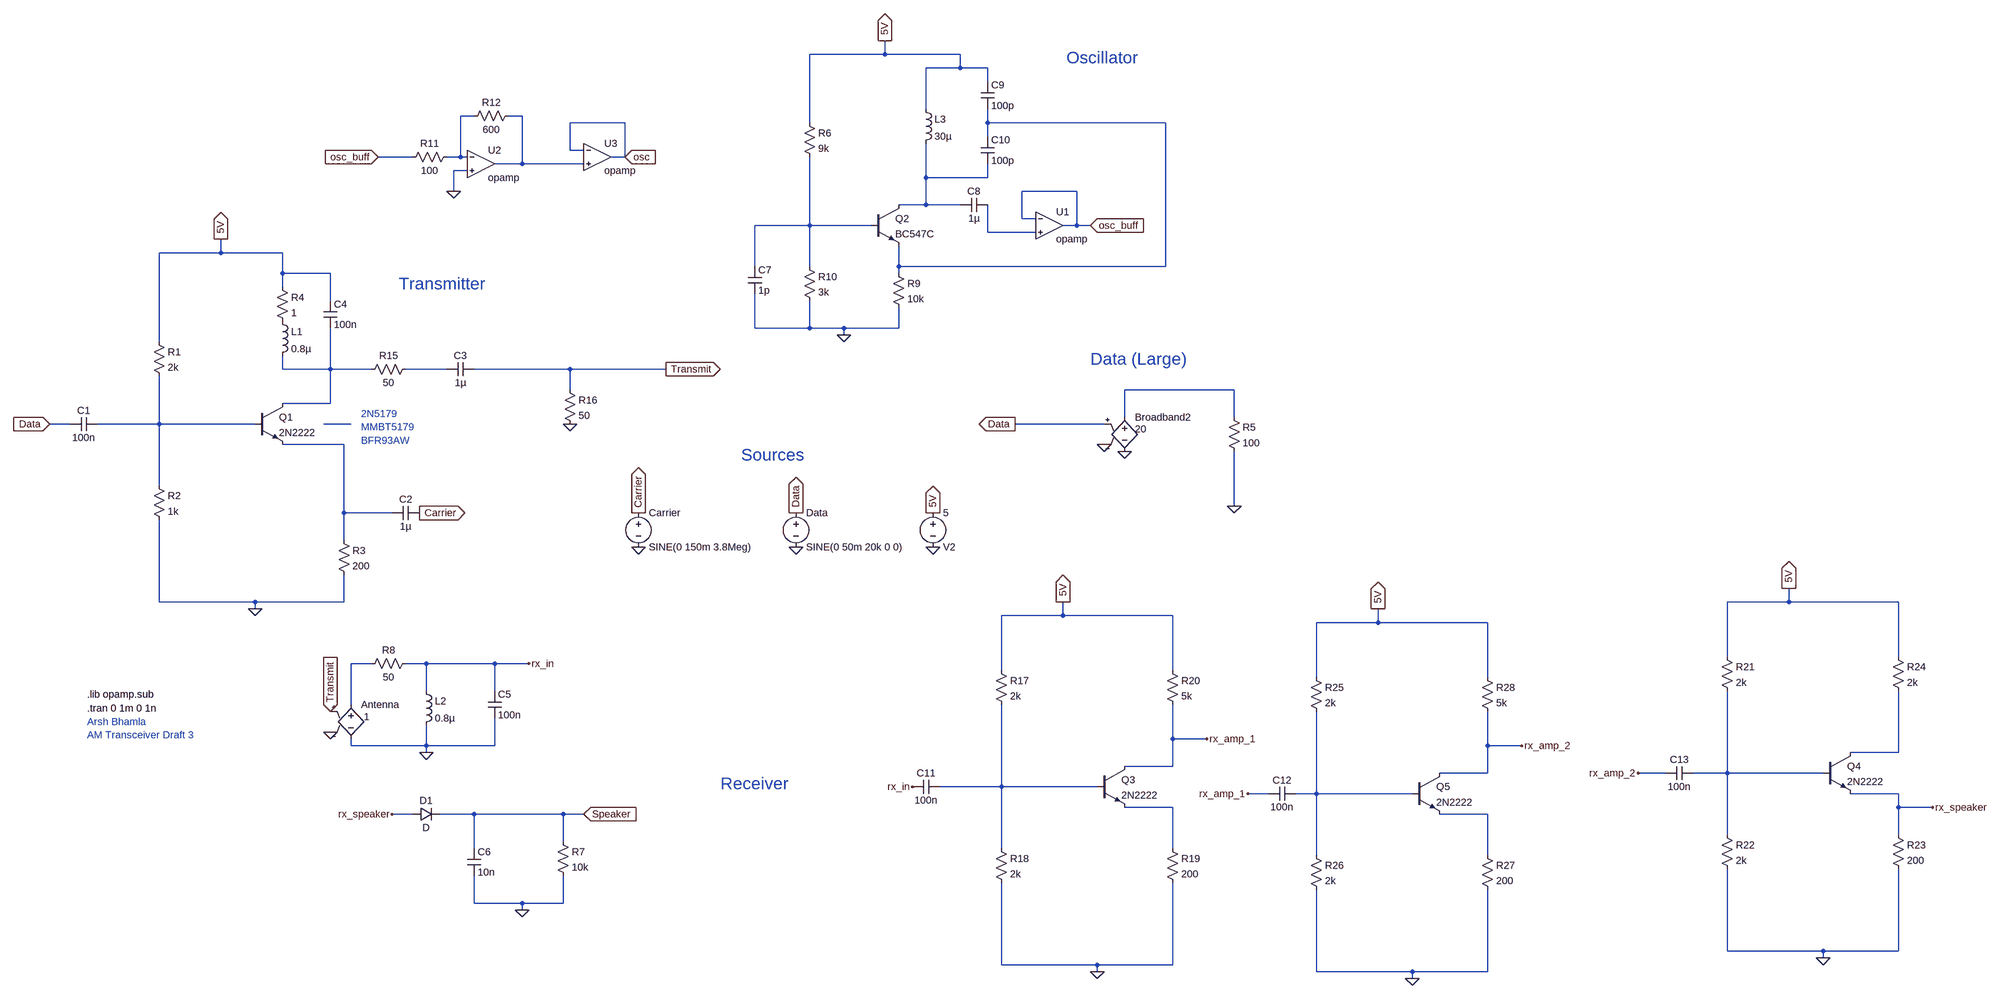
[diagram p0: schematic am_radio_simulation.asc]
am_radio_simulation.asc, the LTspice schematic file:
Version 4.1
SHEET 1 4676 1412
WIRE 2080 -768 2080 -800
WIRE 2080 -768 1904 -768
WIRE 2256 -768 2080 -768
WIRE 2256 -736 2256 -768
WIRE 2256 -736 2176 -736
WIRE 2320 -736 2256 -736
WIRE 2320 -704 2320 -736
WIRE 2176 -640 2176 -736
WIRE 1120 -624 1088 -624
WIRE 1232 -624 1200 -624
WIRE 1472 -608 1344 -608
WIRE 1904 -608 1904 -768
WIRE 2320 -608 2320 -640
WIRE 2736 -608 2320 -608
WIRE 2320 -576 2320 -608
WIRE 1344 -544 1344 -608
WIRE 1376 -544 1344 -544
WIRE 976 -528 896 -528
WIRE 1088 -528 1088 -624
WIRE 1088 -528 1056 -528
WIRE 1104 -528 1088 -528
WIRE 1472 -528 1472 -608
WIRE 1472 -528 1440 -528
WIRE 1232 -512 1232 -624
WIRE 1232 -512 1168 -512
WIRE 1376 -512 1232 -512
WIRE 1104 -496 1072 -496
WIRE 2176 -480 2176 -560
WIRE 2320 -480 2320 -512
WIRE 2320 -480 2176 -480
WIRE 1072 -448 1072 -496
WIRE 2528 -448 2400 -448
WIRE 2176 -416 2176 -480
WIRE 2176 -416 2112 -416
WIRE 2256 -416 2176 -416
WIRE 2400 -384 2400 -448
WIRE 2432 -384 2400 -384
WIRE 1904 -368 1904 -528
WIRE 1904 -368 1776 -368
WIRE 2048 -368 1904 -368
WIRE 2528 -368 2528 -448
WIRE 2528 -368 2496 -368
WIRE 2560 -368 2528 -368
WIRE 2320 -352 2320 -416
WIRE 2432 -352 2320 -352
WIRE 528 -304 528 -336
WIRE 528 -304 384 -304
WIRE 672 -304 528 -304
WIRE 1776 -272 1776 -368
WIRE 1904 -272 1904 -368
WIRE 2112 -272 2112 -320
WIRE 2736 -272 2736 -608
WIRE 2736 -272 2112 -272
WIRE 672 -256 672 -304
WIRE 784 -256 672 -256
WIRE 2112 -256 2112 -272
WIRE 672 -224 672 -256
WIRE 784 -192 784 -256
WIRE 1776 -128 1776 -208
WIRE 1904 -128 1904 -192
WIRE 1904 -128 1776 -128
WIRE 1984 -128 1904 -128
WIRE 2112 -128 2112 -176
WIRE 2112 -128 1984 -128
WIRE 1984 -112 1984 -128
WIRE 384 -96 384 -304
WIRE 672 -32 672 -64
WIRE 784 -32 784 -128
WIRE 784 -32 672 -32
WIRE 880 -32 784 -32
WIRE 1056 -32 960 -32
WIRE 1344 -32 1120 -32
WIRE 1568 -32 1344 -32
WIRE 1344 16 1344 -32
WIRE 2896 16 2640 16
WIRE 784 48 784 -32
WIRE 784 48 672 48
WIRE 2640 80 2640 16
WIRE 2896 80 2896 16
WIRE 176 96 128 96
WIRE 384 96 384 -16
WIRE 384 96 240 96
WIRE 608 96 384 96
WIRE 832 96 768 96
WIRE 2592 96 2384 96
WIRE 816 144 672 144
WIRE 384 240 384 96
WIRE 2896 288 2896 160
WIRE 816 304 816 144
WIRE 928 304 816 304
WIRE 816 368 816 304
WIRE 384 512 384 320
WIRE 608 512 384 512
WIRE 816 512 816 448
WIRE 816 512 608 512
WIRE 4192 512 4192 480
WIRE 4192 512 4048 512
WIRE 4448 512 4192 512
WIRE 608 528 608 512
WIRE 2496 544 2496 512
WIRE 2496 544 2352 544
WIRE 2752 544 2496 544
WIRE 3232 560 3232 528
WIRE 3232 560 3088 560
WIRE 3488 560 3232 560
WIRE 4048 640 4048 512
WIRE 4448 640 4448 512
WIRE 880 656 832 656
WIRE 1008 656 960 656
WIRE 1168 656 1008 656
WIRE 1248 656 1168 656
WIRE 2352 672 2352 544
WIRE 2752 672 2752 544
WIRE 3088 688 3088 560
WIRE 3488 688 3488 560
WIRE 1008 720 1008 656
WIRE 1168 720 1168 656
WIRE 832 752 832 656
WIRE 2752 832 2752 752
WIRE 2832 832 2752 832
WIRE 832 848 832 832
WIRE 1008 848 1008 800
WIRE 1008 848 832 848
WIRE 1168 848 1168 784
WIRE 1168 848 1008 848
WIRE 3488 848 3488 768
WIRE 3568 848 3488 848
WIRE 1008 864 1008 848
WIRE 4448 864 4448 720
WIRE 4448 864 4336 864
WIRE 2752 896 2752 832
WIRE 2752 896 2640 896
WIRE 3488 912 3488 848
WIRE 3488 912 3376 912
WIRE 3904 912 3840 912
WIRE 4048 912 4048 720
WIRE 4048 912 3968 912
WIRE 4272 912 4048 912
WIRE 2352 944 2352 752
WIRE 2352 944 2208 944
WIRE 2576 944 2352 944
WIRE 2976 960 2928 960
WIRE 3088 960 3088 768
WIRE 3088 960 3040 960
WIRE 3312 960 3088 960
WIRE 4448 960 4336 960
WIRE 2752 992 2640 992
WIRE 4448 992 4448 960
WIRE 4528 992 4448 992
WIRE 976 1008 928 1008
WIRE 1120 1008 1040 1008
WIRE 1328 1008 1120 1008
WIRE 1376 1008 1328 1008
WIRE 3488 1008 3376 1008
WIRE 4048 1056 4048 912
WIRE 4448 1056 4448 992
WIRE 1328 1072 1328 1008
WIRE 1120 1088 1120 1008
WIRE 2352 1088 2352 944
WIRE 2752 1088 2752 992
WIRE 3088 1104 3088 960
WIRE 3488 1104 3488 1008
WIRE 1120 1216 1120 1152
WIRE 1232 1216 1120 1216
WIRE 1328 1216 1328 1152
WIRE 1328 1216 1232 1216
WIRE 1232 1232 1232 1216
WIRE 4048 1328 4048 1136
WIRE 4272 1328 4048 1328
WIRE 4448 1328 4448 1136
WIRE 4448 1328 4272 1328
WIRE 4272 1344 4272 1328
WIRE 2352 1360 2352 1168
WIRE 2576 1360 2352 1360
WIRE 2752 1360 2752 1168
WIRE 2752 1360 2576 1360
WIRE 2576 1376 2576 1360
WIRE 3088 1376 3088 1184
WIRE 3312 1376 3088 1376
WIRE 3488 1376 3488 1184
WIRE 3488 1376 3312 1376
WIRE 3312 1392 3312 1376
FLAG 1872 384 0
FLAG 608 528 0
FLAG 2192 384 0
FLAG 1344 96 0
FLAG 784 816 0
FLAG 1232 1232 0
FLAG 2192 304 5V
IOPIN 2192 304 Out
FLAG 528 -336 5V
IOPIN 528 -336 Out
FLAG 1872 304 Data
IOPIN 1872 304 Out
FLAG 128 96 Data
IOPIN 128 96 In
FLAG 1504 384 0
FLAG 1504 304 Carrier
IOPIN 1504 304 Out
FLAG 1568 -32 Transmit
IOPIN 1568 -32 Out
FLAG 784 768 Transmit
IOPIN 784 768 In
FLAG 1008 864 0
FLAG 1376 1008 Speaker
IOPIN 1376 1008 In
FLAG 2384 96 Data
IOPIN 2384 96 Out
FLAG 2592 144 0
FLAG 2640 160 0
FLAG 2896 288 0
FLAG 1984 -112 0
FLAG 2080 -800 5V
IOPIN 2080 -800 Out
FLAG 2560 -368 osc_buff
IOPIN 2560 -368 In
FLAG 896 -528 osc_buff
IOPIN 896 -528 In
FLAG 1072 -448 0
FLAG 1472 -528 osc
IOPIN 1472 -528 In
FLAG 1248 656 rx_in
FLAG 928 1008 rx_speaker
FLAG 2576 1376 0
FLAG 2496 512 5V
IOPIN 2496 512 Out
FLAG 2832 832 rx_amp_1
FLAG 4272 1344 0
FLAG 4192 480 5V
IOPIN 4192 480 Out
FLAG 3840 912 rx_amp_2
FLAG 4528 992 rx_speaker
FLAG 2144 944 rx_in
FLAG 3312 1392 0
FLAG 3232 528 5V
IOPIN 3232 528 Out
FLAG 3568 848 rx_amp_2
FLAG 2928 960 rx_amp_1
FLAG 992 304 Carrier
IOPIN 992 304 Out
SYMBOL voltage 1872 288 R0
WINDOW 123 0 0 Left 0
WINDOW 39 0 0 Left 0
SYMATTR InstName Data
SYMATTR Value SINE(0 50m 20k 0 0)
SYMBOL cap 240 80 R90
WINDOW 0 0 32 VBottom 2
WINDOW 3 32 32 VTop 2
SYMATTR InstName C1
SYMATTR Value 100n
SYMBOL res 368 -112 R0
SYMATTR InstName R1
SYMATTR Value 2k
SYMBOL res 368 224 R0
SYMATTR InstName R2
SYMATTR Value 1k
SYMBOL voltage 2192 288 R0
WINDOW 0 24 96 Left 2
WINDOW 3 24 16 Left 2
WINDOW 123 0 0 Left 0
WINDOW 39 0 0 Left 0
SYMATTR InstName V2
SYMATTR Value 5
SYMBOL voltage 1504 288 R0
WINDOW 123 0 0 Left 0
WINDOW 39 0 0 Left 0
SYMATTR InstName Carrier
SYMATTR Value SINE(0 150m 3.8Meg)
SYMBOL cap 992 288 R90
WINDOW 0 0 32 VBottom 2
WINDOW 3 32 32 VTop 2
SYMATTR InstName C2
SYMATTR Value 1µ
SYMBOL res 800 352 R0
SYMATTR InstName R3
SYMATTR Value 200
SYMBOL npn 608 48 R0
SYMATTR InstName Q1
SYMATTR Value 2N2222
SYMBOL cap 1120 -48 R90
WINDOW 0 0 32 VBottom 2
WINDOW 3 32 32 VTop 2
SYMATTR InstName C3
SYMATTR Value 1µ
SYMBOL res 656 -240 R0
SYMATTR InstName R4
SYMATTR Value 1
SYMBOL res 1328 0 R0
SYMATTR InstName R16
SYMATTR Value 50
SYMBOL e 832 736 R0
WINDOW 3 24 44 Left 2
SYMATTR Value .1
SYMATTR InstName Antenna
SYMBOL ind 656 -160 R0
SYMATTR InstName L1
SYMATTR Value 0.8µ
SYMBOL cap 768 -192 R0
SYMATTR InstName C4
SYMATTR Value 100n
SYMBOL res 976 -48 R90
WINDOW 0 0 56 VBottom 2
WINDOW 3 32 56 VTop 2
SYMATTR InstName R15
SYMATTR Value 50
SYMBOL ind 992 704 R0
SYMATTR InstName L2
SYMATTR Value 0.8µ
SYMBOL cap 1152 720 R0
SYMATTR InstName C5
SYMATTR Value 100n
SYMBOL diode 976 1024 R270
WINDOW 0 32 32 VTop 2
WINDOW 3 0 32 VBottom 2
SYMATTR InstName D1
SYMBOL cap 1104 1088 R0
SYMATTR InstName C6
SYMATTR Value 10n
SYMBOL res 1312 1056 R0
SYMATTR InstName R7
SYMATTR Value 10k
SYMBOL res 976 640 R90
WINDOW 0 0 56 VBottom 2
WINDOW 3 32 56 VTop 2
SYMATTR InstName R8
SYMATTR Value 50
SYMBOL e 2640 64 R0
WINDOW 3 24 44 Left 2
SYMATTR Value 20
SYMATTR InstName Broadband2
SYMBOL res 2880 64 R0
SYMATTR InstName R5
SYMATTR Value 100
SYMBOL res 1888 -624 R0
SYMATTR InstName R6
SYMATTR Value 9k
SYMBOL npn 2048 -416 R0
SYMATTR InstName Q2
SYMATTR Value BC547C
SYMBOL res 2096 -272 R0
SYMATTR InstName R9
SYMATTR Value 10k
SYMBOL res 1888 -288 R0
SYMATTR InstName R10
SYMATTR Value 3k
SYMBOL cap 1760 -272 R0
SYMATTR InstName C7
SYMATTR Value 1p
SYMBOL cap 2320 -432 R90
WINDOW 0 0 32 VBottom 2
WINDOW 3 32 32 VTop 2
SYMATTR InstName C8
SYMATTR Value 1µ
SYMBOL cap 2304 -704 R0
SYMATTR InstName C9
SYMATTR Value 100p
SYMBOL cap 2304 -576 R0
SYMATTR InstName C10
SYMATTR Value 100p
SYMBOL ind 2160 -656 R0
SYMATTR InstName L3
SYMATTR Value 30µ
SYMBOL OpAmps\\opamp 2464 -432 R0
SYMATTR InstName U1
SYMBOL OpAmps\\opamp 1136 -576 R0
SYMATTR InstName U2
SYMBOL res 1072 -544 R90
WINDOW 0 0 56 VBottom 2
WINDOW 3 32 56 VTop 2
SYMATTR InstName R11
SYMATTR Value 100
SYMBOL res 1216 -640 R90
WINDOW 0 0 56 VBottom 2
WINDOW 3 32 56 VTop 2
SYMATTR InstName R12
SYMATTR Value 600
SYMBOL OpAmps\\opamp 1408 -592 R0
SYMATTR InstName U3
SYMBOL res 2336 656 R0
SYMATTR InstName R17
SYMATTR Value 2k
SYMBOL res 2336 1072 R0
SYMATTR InstName R18
SYMATTR Value 2k
SYMBOL res 2736 1072 R0
SYMATTR InstName R19
SYMATTR Value 200
SYMBOL npn 2576 896 R0
SYMATTR InstName Q3
SYMATTR Value 2N2222
SYMBOL res 2736 656 R0
SYMATTR InstName R20
SYMATTR Value 5k
SYMBOL res 4032 624 R0
SYMATTR InstName R21
SYMATTR Value 2k
SYMBOL res 4032 1040 R0
SYMATTR InstName R22
SYMATTR Value 2k
SYMBOL res 4432 1040 R0
SYMATTR InstName R23
SYMATTR Value 200
SYMBOL npn 4272 864 R0
SYMATTR InstName Q4
SYMATTR Value 2N2222
SYMBOL res 4432 624 R0
SYMATTR InstName R24
SYMATTR Value 2k
SYMBOL cap 2208 928 R90
WINDOW 0 0 32 VBottom 2
WINDOW 3 32 32 VTop 2
SYMATTR InstName C11
SYMATTR Value 100n
SYMBOL res 3072 672 R0
SYMATTR InstName R25
SYMATTR Value 2k
SYMBOL res 3072 1088 R0
SYMATTR InstName R26
SYMATTR Value 2k
SYMBOL res 3472 1088 R0
SYMATTR InstName R27
SYMATTR Value 200
SYMBOL npn 3312 912 R0
SYMATTR InstName Q5
SYMATTR Value 2N2222
SYMBOL res 3472 672 R0
SYMATTR InstName R28
SYMATTR Value 5k
SYMBOL cap 3040 944 R90
WINDOW 0 0 32 VBottom 2
WINDOW 3 32 32 VTop 2
SYMATTR InstName C12
SYMATTR Value 100n
SYMBOL cap 3968 896 R90
WINDOW 0 0 32 VBottom 2
WINDOW 3 32 32 VTop 2
SYMATTR InstName C13
SYMATTR Value 100n
TEXT 856 72 Left 2 ;2N5179\nMMBT5179\nBFR93AW
TEXT 944 -232 Left 4 ;Transmitter
TEXT 1696 936 Left 4 ;Receiver
TEXT 216 792 Left 2 ;Arsh Bhamla\nAM Transceiver Draft 3
TEXT 216 760 Left 2 !.tran 0 1m 0 1n
TEXT 2560 -56 Left 4 ;Data (Large)
TEXT 1744 168 Left 4 ;Sources
TEXT 2504 -760 Left 4 ;Oscillator
TEXT 216 728 Left 2 !.lib opamp.sub

The netlist it stands for:
* am_radio_simulation.asc
V§Data Data 0 SINE(0 50m 20k 0 0)
C1 N010 Data 100n
R1 5V N010 2k
R2 N010 0 1k
V2 5V 0 5
V§Carrier Carrier 0 SINE(0 150m 3.8Meg)
C2 Carrier N012 1µ
R3 N012 0 200
Q1 N007 N010 N012 0 2N2222
C3 Transmit N008 1µ
R4 5V P001 1
R16 Transmit 0 50
E§Antenna N013 0 Transmit 0 .1
L1 P001 N007 0.8µ
C4 5V N007 100n
R15 N008 N007 50
L2 rx_in 0 0.8µ
C5 rx_in 0 100n
D1 rx_speaker Speaker D
C6 Speaker 0 10n
R7 Speaker 0 10k
R8 rx_in N013 50
E§Broadband2 N009 0 Data 0 20
R5 N009 0 100
R6 5V N005 9k
Q2 N004 N005 N003 0 BC547C
R9 N003 0 10k
R10 N005 0 3k
C7 N005 0 1p
C8 N006 N004 1µ
C9 5V N003 100p
C10 N003 N004 100p
L3 5V N004 30µ
X§U1 osc_buff N006 osc_buff opamp Aol=100K GBW=10Meg  ; pins invin noninvin out
X§U2 N001 0 N002 opamp Aol=100K GBW=10Meg  ; pins invin noninvin out
R11 N001 osc_buff 100
R12 N002 N001 600
X§U3 osc N002 osc opamp Aol=100K GBW=10Meg  ; pins invin noninvin out
R17 5V N016 2k
R18 N016 0 2k
R19 N018 0 200
Q3 rx_amp_1 N016 N018 0 2N2222
R20 5V rx_amp_1 5k
R21 5V N015 2k
R22 N015 0 2k
R23 rx_speaker 0 200
Q4 N014 N015 rx_speaker 0 2N2222
R24 5V N014 2k
C11 N016 rx_in 100n
R25 5V N017 2k
R26 N017 0 2k
R27 N019 0 200
Q5 rx_amp_2 N017 N019 0 2N2222
R28 5V rx_amp_2 5k
C12 N017 rx_amp_1 100n
C13 N015 rx_amp_2 100n
.model D D
.lib standard.dio
.model NPN NPN
.model PNP PNP
.lib standard.bjt
* 2N5179
* MMBT5179
* BFR93AW
* Transmitter
* Receiver
* Arsh Bhamla
* AM Transceiver Draft 3
.tran 0 1m 0 1n
* Data (Large)
* Sources
* Oscillator
.lib opamp.sub
.backanno
.end